# EasyEDA Pro project USB转串口.eprj

# Schematic USB转串口原理图
Board Name: USB转串口; Create Date: 2025-07-15; Page Name: P1; Project Name: USB转串口; Schematic Name: USB转串口原理图; Update Date: 2025-07-18; Company: 嘉立创EDA; Page Size: A4; Version: V1.0
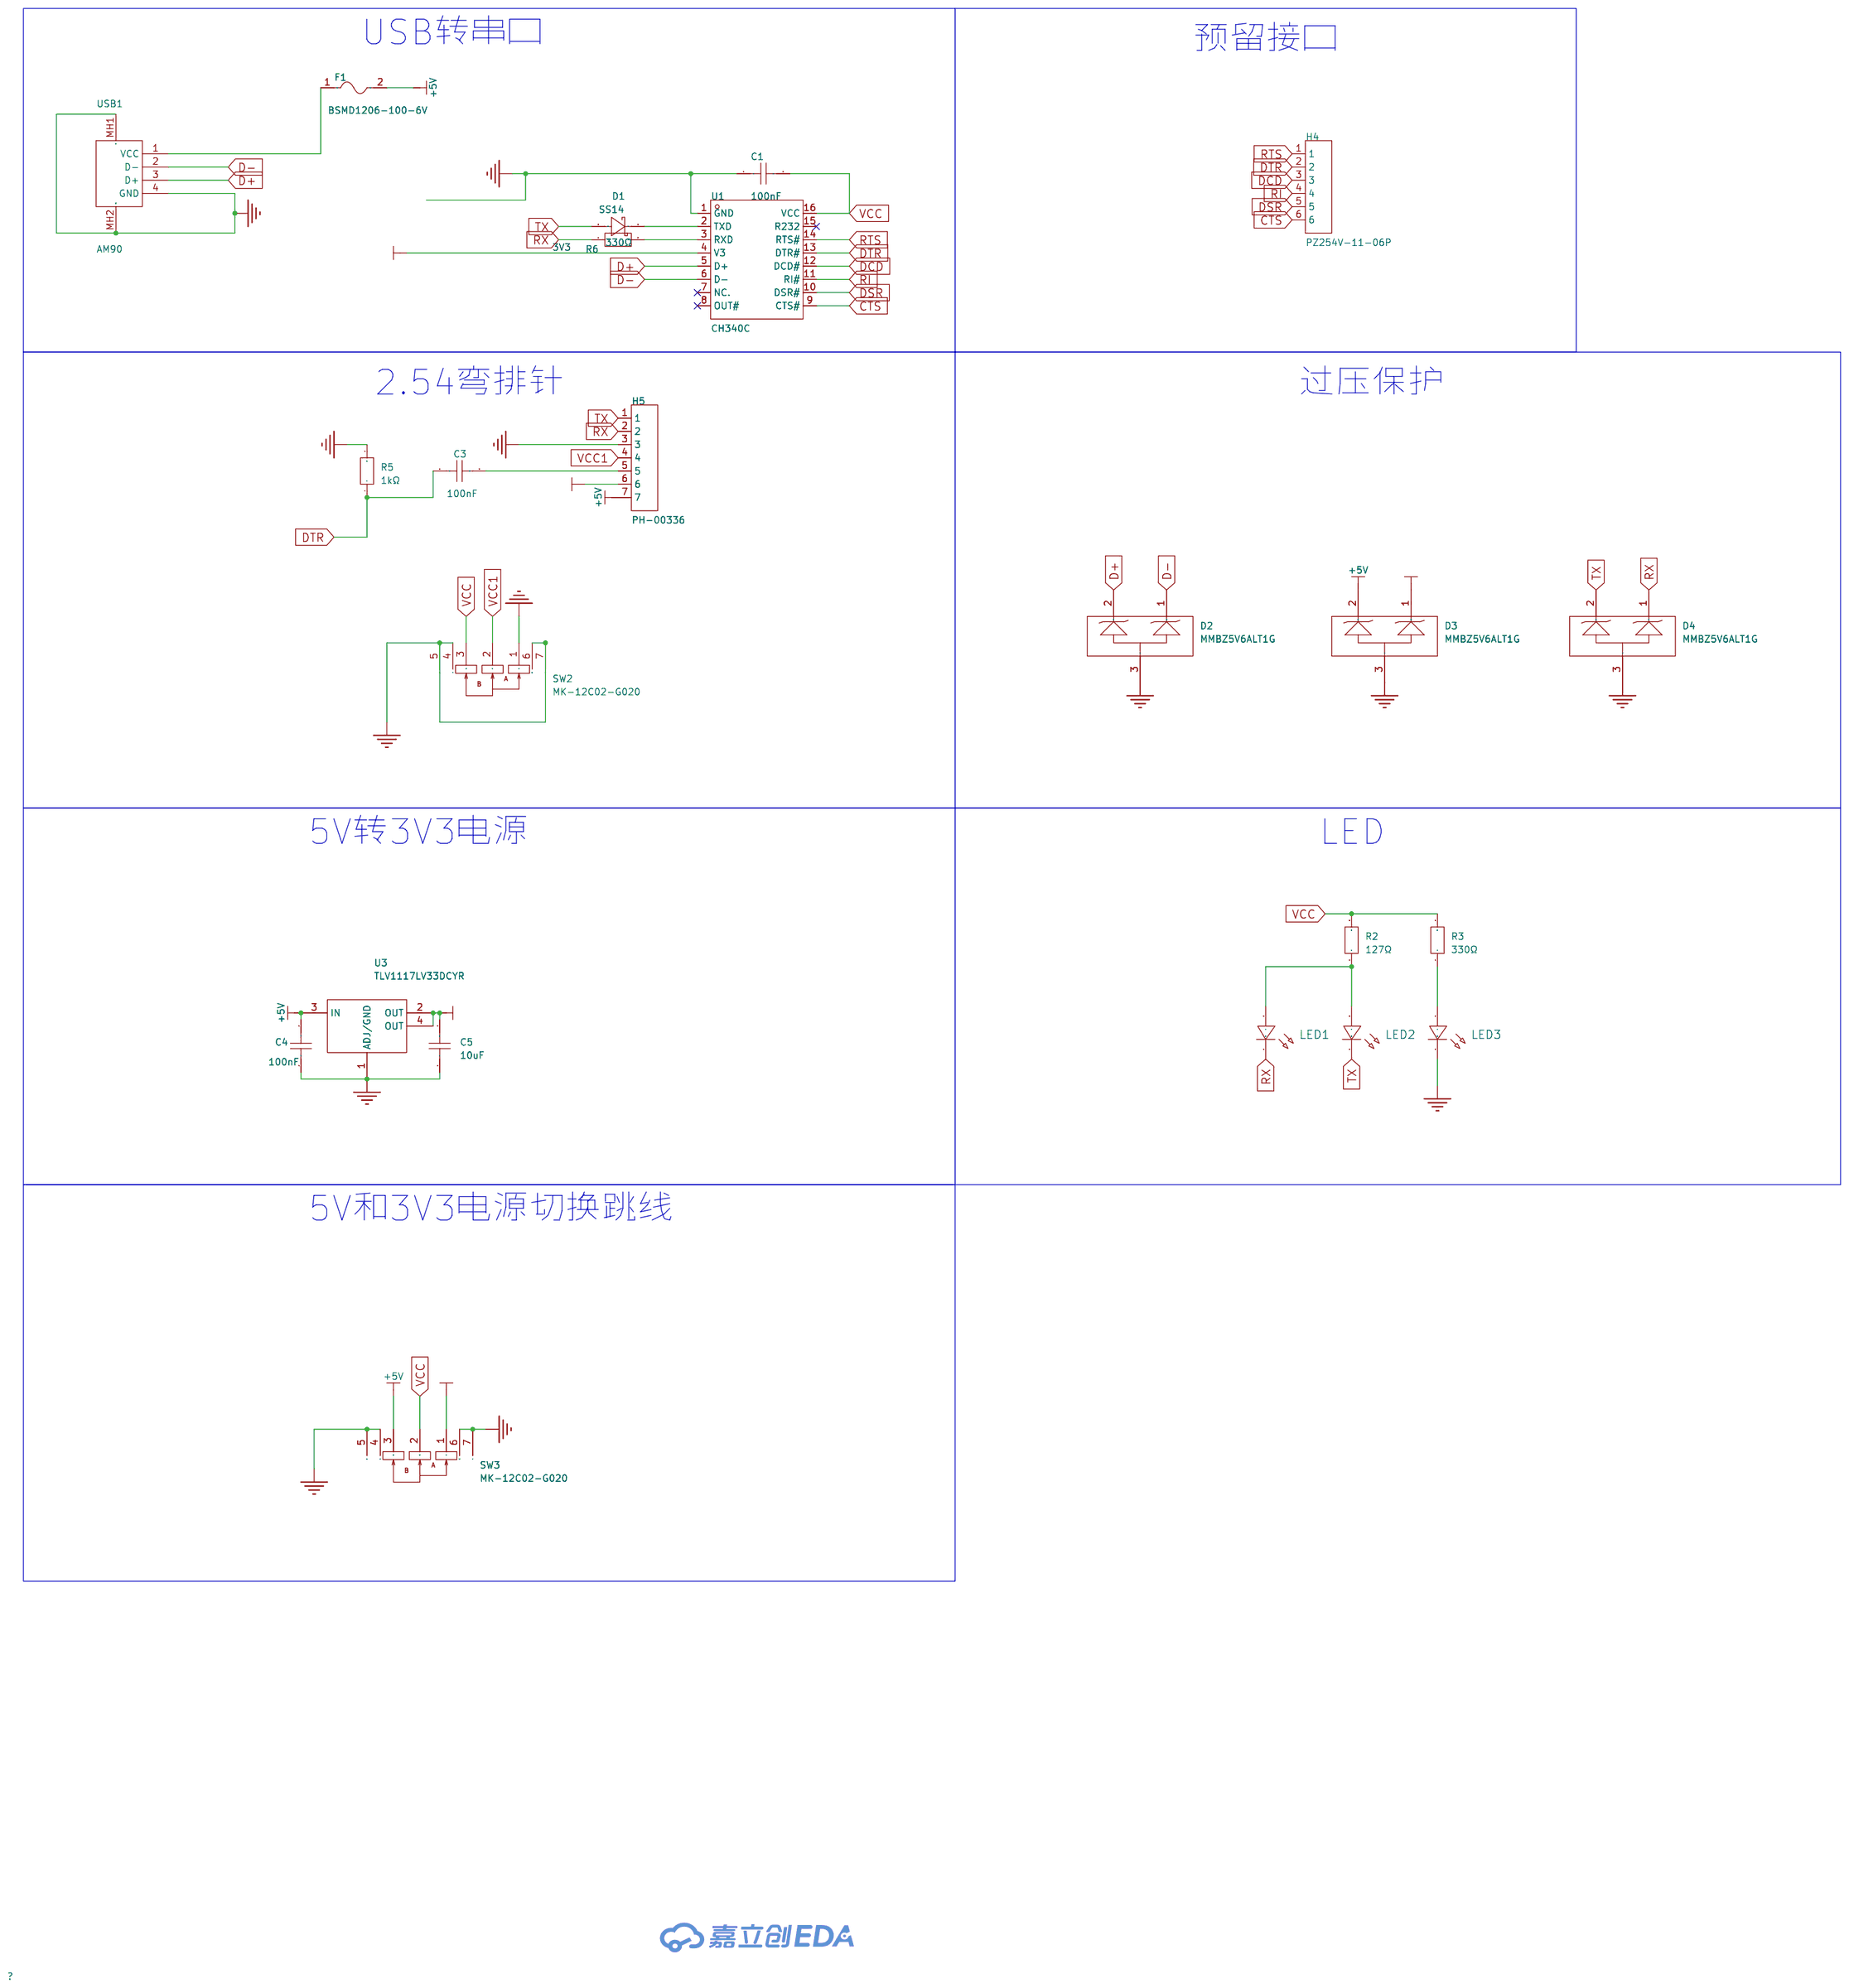
[diagram p0: schematic sheet]

## Parts
C1  100nF  [C0805]
C3  100nF  [C0805]
C4  100nF  [C0805]
C5  10uF  [C0805]
D1  SS14  [SMA_L4.3-W2.6-LS5.0-RD]
D2  MMBZ5V6ALT1G  [SOT-23_L2.9-W1.3-P1.90-LS2.4-BR]
D3  MMBZ5V6ALT1G  [SOT-23_L2.9-W1.3-P1.90-LS2.4-BR]
D4  MMBZ5V6ALT1G  [SOT-23_L2.9-W1.3-P1.90-LS2.4-BR]
F1  BSMD1206-100-6V  [F1206]
H4  PZ254V-11-06P  [HDR-TH_6P-P2.54-V-M]
H5  PH-00336  [HDR-TH_7P-P2.54-V-M]
LED1  -  [LED_0603]
LED2  -  [LED_0603]
LED3  -  [LED_0603]
R2  127Ω  [R0805]
R3  330Ω  [R0805]
R5  1kΩ  [R0805]
R6  330Ω  [R0805]
SW2  MK-12C02-G020  [SW-SMD_MK-12C02-G020]
SW3  MK-12C02-G020  [SW-SMD_MK-12C02-G020]
U1  CH340C  [SOP-16_L10.0-W3.9-P1.27-LS6.0-BL]
U3  TLV1117LV33DCYR  [SOT-223_L6.7-W3.5-P2.30-BR]
USB1  AM90  [USB-AM-TH_AM90]

## Library data of the parts
C1 C3 C4 = 08055C104KAT4A: LCSC Part Name: 100nF ±10% 50V; Supplier Part: C2167422; Manufacturer: Kyocera AVX; Supplier Footprint: 0805; JLCPCB Part Class: 扩展库; Datasheet: https://atta.szlcsc.com/upload/public/pdf/source/20211125/9559F68C371FC513E807C3C71A51015C.pdf; Supplier: LCSC; Tolerance: ±10%; Voltage Rating: 50V; Temperature Coefficient: X7R
C5 = CGA0805X6S106M160MT: LCSC Part Name: 10uF ±20% 16V; Supplier Part: C6119910; Manufacturer: HRE(芯声); Supplier Footprint: 0805; JLCPCB Part Class: 扩展库; Supplier: LCSC; Tolerance: ±20%; Voltage Rating: 16V; Temperature Coefficient: X6S
D1 = SS14_C727050: LCSC Part Name: 电压:40V 电流:1A; Supplier Part: C727050; Manufacturer: TWGMC(台湾迪嘉); Supplier Footprint: SMA(DO-214AC); JLCPCB Part Class: 扩展库; Datasheet: https://atta.szlcsc.com/upload/public/pdf/source/20200828/C727049_15C374FD74575EB3C6CB20C4F8F2D77A.pdf; Supplier: LCSC; Diode Configuration: 独立式; Forward Voltage (Vf@If): 550mV@1A; Reverse Voltage (Vr): 40V; Rectified Current: 1A; Reverse Leakage Current (Ir): 500uA
D2-D4 = MMBZ5V6ALT1G: Supplier Part: C123251; Manufacturer: onsemi(安森美); Supplier Footprint: SOT-23; JLCPCB Part Class: 扩展库; Datasheet: https://atta.szlcsc.com/upload/public/pdf/source/20180316/64EDD40BDF72533A9556DC091004FF68.pdf; Supplier: LCSC; Reverse Stand-Off Voltage (Vrwm): 3V; Maximum Clamping Voltage: 8V; Peak Pulse Power Dissipation (Ppp)@10/1000us: 24W; Breakdown Voltage: 5.32V; Number of Lines: 双路; Operating Temperature: -55℃~+150℃@(Tj); Type: ESD
F1 = BSMD1206-100-6V: LCSC Part Name: 1206 1A 6V 国产自恢复; Supplier Part: C883129; Manufacturer: BHFUSE(佰宏); Supplier Footprint: 1206; JLCPCB Part Class: 扩展库; Datasheet: https://atta.szlcsc.com/upload/public/pdf/source/20250212/FB96FB30E33193B14368CE94976BC83E.pdf; Supplier: LCSC; Voltage - Max: 6V; Current - Max: 100A; Hold Current: 1A; Trip Current: 1.8A; Power Dissipation: 800mW; Resistance - Initial (Ri) (Min): 50mΩ; Resistance - Post Trip (R1) (Max): 270mΩ; Time to Trip(Max): 300ms; Operating Temperature: -40℃~+85℃
H4 = PZ254V-11-06P: LCSC Part Name: 1x6P 间距:2.54mm 方针 直插; Supplier Part: C492405; Manufacturer: XFCN(兴飞); Supplier Footprint: 插件,P=2.54mm; JLCPCB Part Class: 扩展库; Datasheet: https://atta.szlcsc.com/upload/public/pdf/source/20200309/C492405_597F1930F5B55CC3C7FD95458F1C3977.pdf; Supplier: LCSC; Pin Structure: 1x6P; Pitch: 2.54mm; Circluar Pins/Square Pins: 方针; Mounting Type: 直插; Number of Rows: 单排; Number of Pins: 6P; Length of Mating Pin: 6mm; Insulation Height: 2.5mm; Length of End Connection Pin: 3mm; Contact Material: 黄铜; Operating Temperature: -40℃~+105℃; Color: 黑色
H5 = PH-00336: LCSC Part Name: 1x7P 间距:2.54mm 方针 直插; Supplier Part: C2685153; Manufacturer: Liansheng(连盛); Supplier Footprint: 插件,P=2.54mm; JLCPCB Part Class: 扩展库; Datasheet: https://atta.szlcsc.com/upload/public/pdf/source/20210125/C2685153_3D52DE13B40DCDA378EF140FF7C18578.pdf; Supplier: LCSC; Pin Structure: 1x7P; Pitch: 2.54mm; Circluar Pins/Square Pins: 方针; Mounting Type: 直插; Number of Rows: 单排; Number of Pins: 7P; Current Rating: 3A; Length of Mating Pin: 6mm; Insulation Height: 2.5mm; Length of End Connection Pin: 3mm; Operating Temperature: -40℃~+105℃; Color: 黑色
LED1-LED3 = LED_0603-R: Supplier Footprint: 0603
R2 = FRC0805F1270TS: LCSC Part Name: 127Ω ±1% 125mW 厚膜电阻; Supplier Part: C5159710; Manufacturer: FOJAN(富捷); Supplier Footprint: 0805; JLCPCB Part Class: 扩展库; Datasheet: https://atta.szlcsc.com/upload/public/pdf/source/20211221/925EC7D7225764EE0046F22065062C87.pdf; Supplier: LCSC; Type: 厚膜电阻; Tolerance: ±1%; Power(Watts): 125mW; Voltage-Supply(Max): 150V; Temperature Coefficient: ±100ppm/℃
R3 R6 = CRCW0805330RJNEA: LCSC Part Name: 厚膜电阻 330Ω ±5% 125mW; Supplier Part: C844209; Manufacturer: VISHAY(威世); Supplier Footprint: 0805; JLCPCB Part Class: 扩展库; Datasheet: https://atta.szlcsc.com/upload/public/pdf/source/20200927/C844045_6AA1A6DF5B555BABAEE9BB169E8C33AD.pdf; Supplier: LCSC; Type: 厚膜电阻; Tolerance: ±5%; Power(Watts): 125mW; Temperature Coefficient: ±200ppm/℃; Operating Temperature: -55℃~+155℃
R5 = HP05W3F1001T5E: LCSC Part Name: 1kΩ ±1% 333.333mW 厚膜电阻; Supplier Part: C2759346; Manufacturer: UNI-ROYAL(厚声); Supplier Footprint: 0805; JLCPCB Part Class: 扩展库; Datasheet: https://atta.szlcsc.com/upload/public/pdf/source/20191008/C414992_156DFCF59DCF6D7D87D733C605AEA251.pdf; Supplier: LCSC; Type: 厚膜电阻; Tolerance: ±1%; Power(Watts): 333mW; Voltage-Supply(Max): 150V; Temperature Coefficient: ±100ppm/℃; Operating Temperature: -55℃~+155℃
SW2 SW3 = MK-12C02-G020: LCSC Part Name: 微型拨动开关; Supplier Part: C963206; Manufacturer: G-Switch(品赞); Supplier Footprint: SMD; JLCPCB Part Class: 扩展库; Datasheet: https://atta.szlcsc.com/upload/public/pdf/source/20200902/C778186_2AF08473ED98414D93A175E8814EEFA6.pdf; Supplier: LCSC; Circuit: 单刀双掷; Actuator Style: 矩形柱状; Pin Style: SMD接片; Switch Length: 6.6mm; Switch Width: 2.7mm; Switch Height: 4.7mm; Mounting Style: 卧贴; Actuator Color: 黑色; Current Rating (DC): 1A; Voltage Rating (DC): 6V; Mechanical Life: 1万次; Operating Temperature: -20℃~+70℃
U1 = CH340C: Supplier Part: C84681; Manufacturer: WCH(南京沁恒); Supplier Footprint: SOP-16; JLCPCB Part Class: 扩展库; Datasheet: https://atta.szlcsc.com/upload/public/pdf/source/20240619/63986D8440D4E5267A77ACD891CC4DE3.pdf; Supplier: LCSC; Applications Function: 收发器; Protocol: USB 2.0; Voltage - Supply: 3.3V；5V; Data Rate: 2Mbps
U3 = TLV1117LV33DCYR: LCSC Part Name: 1A 低压降稳压器; Supplier Part: C15578; Manufacturer: TI(德州仪器); Supplier Footprint: SOT-223; JLCPCB Part Class: 扩展库; Datasheet: https://www.ti.com/cn/lit/gpn/tlv1117lv; Supplier: LCSC; Output Type: 固定; Maximum Input Voltage: 5.5V; Output Voltage: 3.3V; Output Current: 1A; Power Supply Rejection Ratio (PSRR): 75dB@(120Hz); Dropout Voltage: 1.3V@(800mA); standby current: 100uA; Feature: 防静电保护；低ESR；热保护(TSD)；过流保护(OCP)；欠压闭锁; Operating Temperature: -40℃~+125℃; Output Polarity: 正极; Number of Outputs: 1
USB1 = AM90: LCSC Part Name: Type-A 公 弯插; Supplier Part: C404965; Manufacturer: SHOU HAN(首韩); Supplier Footprint: 插件; JLCPCB Part Class: 扩展库; Datasheet: https://atta.szlcsc.com/upload/public/pdf/source/20190722/C404965_9CC10BE28E3F9E5134758D030387C529.pdf; Supplier: LCSC; Connector Type: Type-A; Standard: USB 2.0; Gender: 公; Mounting Style: 弯插; Number of Contacts: 4P; Number of Ports: 1; Current Rating - Power (Max): 1.5A; Rated Voltage (Max): 30V; Connect-Disconnect Life: 5千次; Length: 18.8mm; Core Colour: 白色; Operating Temperature Range: -25℃~+85℃

## Nets
3V3: C5.2 D3.1(C) H5.6 SW3.1 U1.4(V3) U3.2(OUT) U3.4(OUT)
+5V: C4.2 D3.2(C) F1.2 H5.7 SW3.3 U3.3(IN)
GND: C1.1 C4.1 C5.1 D2.3(A) D3.3(A) D4.3(A) H5.3 LED3.1(C) R5.2 SW2.1 SW2.4 SW2.5 SW2.6 SW2.7 SW3.4 SW3.5 SW3.6 SW3.7 U1.1(GND) U3.1(ADJ/GND) USB1.4(GND) USB1.MH1 USB1.MH2
VCC: C1.2 R2.2 R3.2 SW2.3 SW3.2 U1.16(VCC)
VCC1: H5.4 SW2.2
CTS: H4.6 U1.9(CTS#)
D+: D2.2(C) U1.5(D+) USB1.3(D+)
D-: D2.1(C) U1.6(D-) USB1.2(D-)
DCD: H4.3 U1.12(DCD#)
DSR: H4.5 U1.10(DSR#)
DTR: C3.1 H4.2 R5.1 U1.13(DTR#)
RI: H4.4 U1.11(RI#)
RTS: H4.1 U1.14(RTS#)
RX: D4.1(C) H5.2 LED1.1(C) R6.1
TX: D1.2(A) D4.2(C) H5.1 LED2.1(C)
$1N1039: D1.1(K) U1.2(TXD)
$1N1157: R6.2 U1.3(RXD)
$1N1448: F1.1 USB1.1(VCC)
$1N1866: C3.2 H5.5
$1N3736: LED1.2(A) LED2.2(A) R2.1
$1N3753: LED3.2(A) R3.1

Not connected (* = marked no-connect by the designer): U1 7(NC.)* 8(OUT#)* 15(R232)*

## Notes on the sheet
- USB转串口
- 预留接口
- 2.54弯排针
- 过压保护
- 5V转3V3电源
- LED
- 5V和3V3电源切换跳线

# Board USB转串口PCB
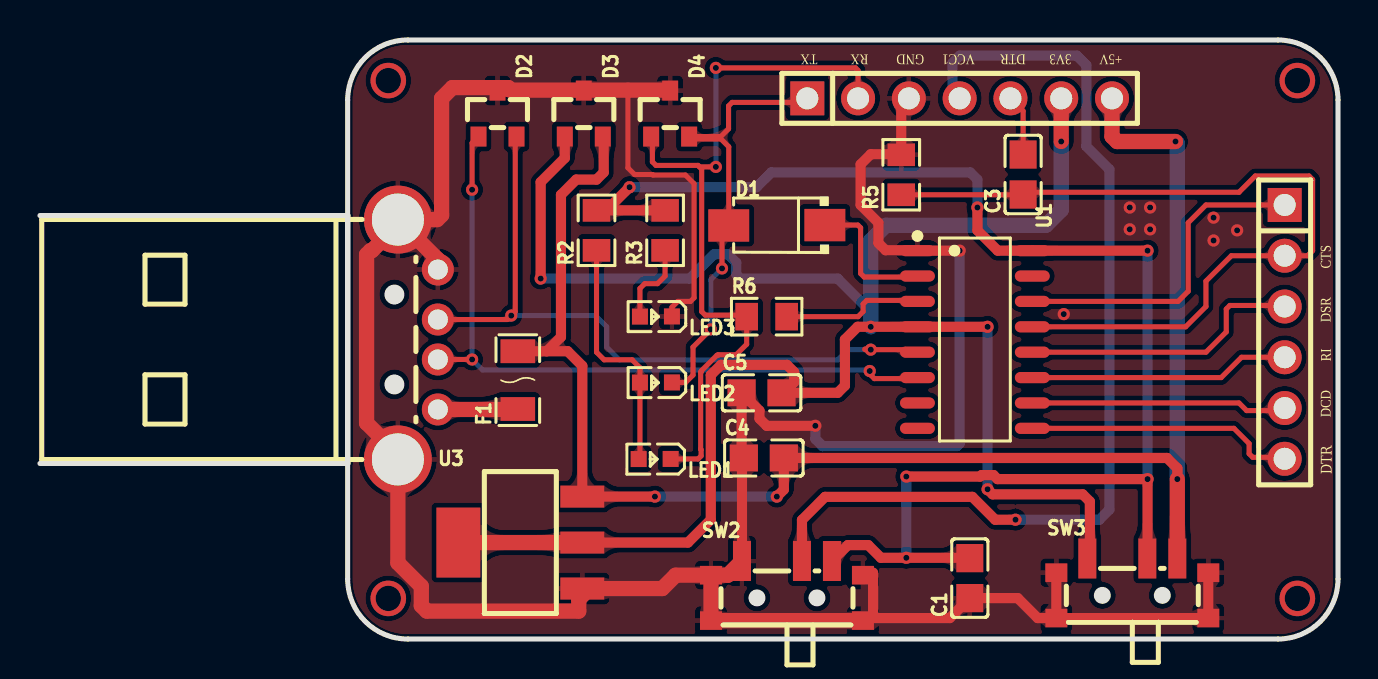
[diagram p1: board, top side]
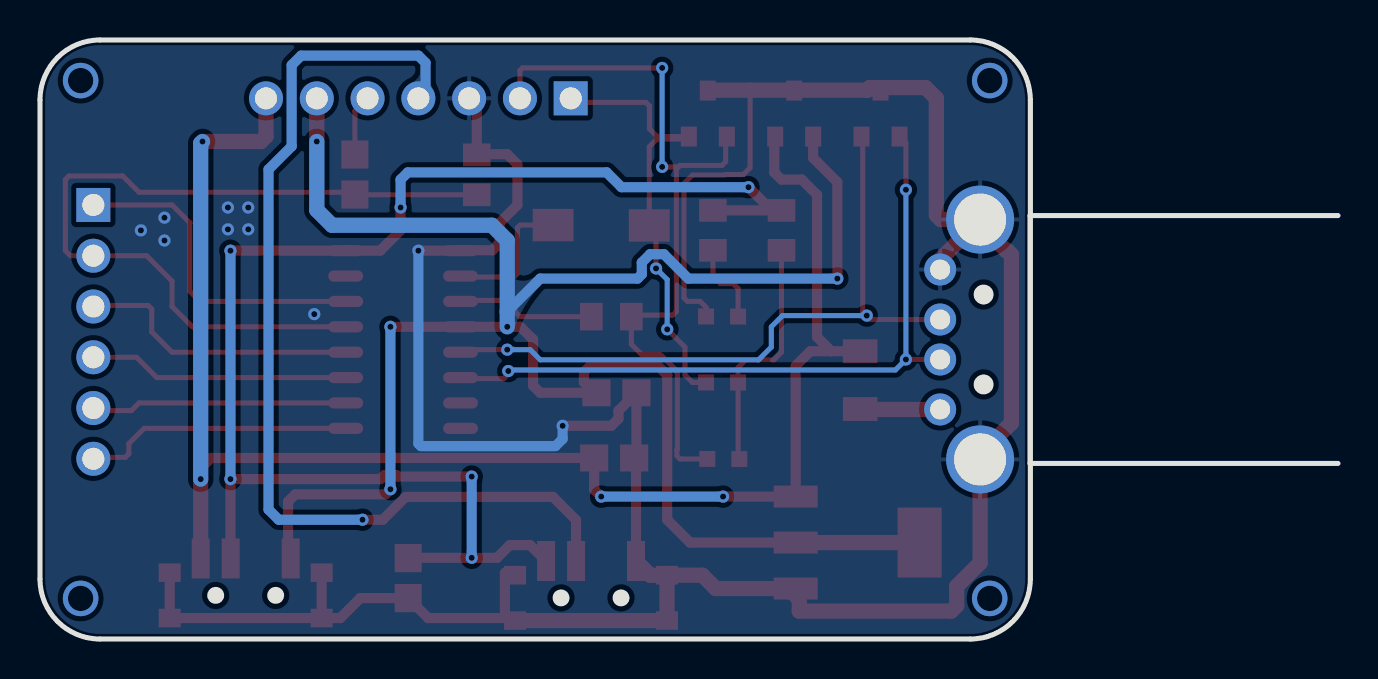
[diagram p2: board, bottom side, seen from below]

Outline 64.92 x 29.97 mm; copper layers: Top Layer, Bottom Layer. Coordinates in mm from the lower left corner of the outline.
Outline path: 15.39,26.97 15.39,3 arc(16.27,0.88) 18.39,0 61.92,0 arc(64.04,0.88) 64.92,3 64.92,26.97 arc(64.04,29.09) 61.92,29.97 18.39,29.97 arc(16.27,29.09) 15.39,26.97
Stack: Top Layer 0.035mm / Dielectric1 1.51mm FR4 er 4.5 / Bottom Layer 0.035mm

## Design rules (mm)
template: JLCPCB Capability(Two Layers Board)
spacing copperThickness1oz (default): track to track 0.102, other pairs 0.152 to 0.3
spacing copperThickness2oz: track to track 0.203, other pairs 0.152 to 0.3
track width copperThickness1oz (default): min 0.127, default 0.254, max 2.54
track width copperThickness2oz: min 0.203, default 0.254, max 2.54
differential pair differentialPair (default): width min 0.127, default 0.254, max 2.54; gap min 0.152, default 0.152
via viaSize (default): diameter min 0.5, default 0.61, max 10; hole min 0.3, default 0.305, max 6.3

## Placement (name value [footprint] x y rotation side)
C1  100nF  [C0805]  46.5 3.05 90 top
C3  100nF  [C0805]  49.17 23.24 90 top
C4  100nF  [C0805]  36.2 9.06 0 top
C5  10uF  [C0805]  36.09 12.32 0 top
D1  SS14  [SMA_L4.3-W2.6-LS5.0-RD]  36.85 20.7 180 top
D2  MMBZ5V6ALT1G  [SOT-23_L2.9-W1.3-P1.90-LS2.4-BR]  22.88 26.29 270 top
D3  MMBZ5V6ALT1G  [SOT-23_L2.9-W1.3-P1.90-LS2.4-BR]  27.2 26.29 270 top
D4  MMBZ5V6ALT1G  [SOT-23_L2.9-W1.3-P1.90-LS2.4-BR]  31.52 26.29 270 top
F1  BSMD1206-100-6V  [F1206]  23.9 12.95 90 top
H4  PZ254V-11-06P  [HDR-TH_6P-P2.54-V-M]  62.25 15.37 270 top
H5  PH-00336  [HDR-TH_7P-P2.54-V-M]  46 27.05 0 top
LED1  -  [LED_0603]  30.69 9 180 top
LED2  -  [LED_0603]  30.76 12.83 180 top
LED3  -  [LED_0603]  30.76 16.13 180 top
R2  127Ω  [R0805]  27.83 20.45 90 top
R3  330Ω  [R0805]  31.26 20.45 90 top
R5  1kΩ  [R0805]  43.07 23.23 90 top
R6  330Ω  [R0805]  36.34 16.13 0 top
SW2  MK-12C02-G020  [SW-SMD_MK-12C02-G020]  37.36 2.41 0 top
SW3  MK-12C02-G020  [SW-SMD_MK-12C02-G020]  54.63 2.54 0 top
U1  CH340C  [SOP-16_L10.0-W3.9-P1.27-LS6.0-BL]  46.76 14.99 270 top
U3  TLV1117LV33DCYR  [SOT-223_L6.7-W3.5-P2.30-BR]  24.02 4.83 0 top
USB1  AM90  [USB-AM-TH_AM90]  18.9 14.99 270 top

## Footprints (pads in the part's own frame, mm; a bottom-side part is the same pattern mirrored in y, then rotated)
C0805
  rect 1.41x1.35 smd: 1(-1,0) 2(1,0)
F1206
  rect 1.19x1.728 smd: 1(-1.445,0) 2(1.445,0)
HDR-TH_6P-P2.54-V-M
  rect 1.7x1.7 hole 1.1: 1(-6.35,0)
  round 1.7 hole 1.1: 2(-3.81,0) 3(-1.27,0) 4(1.27,0) 5(3.81,0) 6(6.35,0)
HDR-TH_7P-P2.54-V-M
  rect 1.7x1.7 hole 1.1: 1(-7.62,0)
  round 1.7 hole 1.1: 2(-5.08,0) 3(-2.54,0) 4(0,0) 5(2.54,0) 6(5.08,0) 7(7.62,0)
LED_0603
  rect 0.8x0.8 smd: 1(-0.851,-0.01) 2(0.75,-0.005)
R0805
  rect 1.133x1.377 smd: 1(-1,0) 2(1,0)
SMA_L4.3-W2.6-LS5.0-RD
  rect 2.046x1.62 smd: 1(-2.404,-0.009) 2(2.404,0.009)
SOP-16_L10.0-W3.9-P1.27-LS6.0-BL
  oval 0.56x1.745 smd: 1(-4.445,-2.873) 2(-3.175,-2.873) 3(-1.905,-2.873) 4(-0.635,-2.873) 5(0.635,-2.873) 6(1.905,-2.873) 7(3.175,-2.873) 8(4.445,-2.873) 9(4.445,2.873) 10(3.175,2.873) 11(1.905,2.873) 12(0.635,2.873) 13(-0.635,2.873) 14(-1.905,2.873) 15(-3.175,2.873) 16(-4.445,2.873)
SOT-23_L2.9-W1.3-P1.90-LS2.4-BR
  rect 1x0.8 smd: 1(1.15,-0.95) 2(1.15,0.95) 3(-1.15,0)
SOT-223_L6.7-W3.5-P2.30-BR
  rect 2.2x1.1 smd: 1(3.099,-2.3) 2(3.099,0) 3(3.099,2.3)
  rect 2.2x3.5 smd: 4(-3.099,0)
SW-SMD_MK-12C02-G020
  rect 0.9x2 smd: 1(-2.25,1.49) 2(0.75,1.49) 3(2.25,1.49)
  rect 1.1x0.93 smd: 4(3.8,0.779) 5(3.8,-1.49) 6(-3.8,-1.49) 7(-3.8,0.779)
USB-AM-TH_AM90
  round 1.6 hole 1: 1(3.5,1) 2(1,1) 3(-1,1) 4(-3.5,1)
  round 3.4 hole 2.6: MH1(6,-1) MH2(-6,-1)

## Nets
As in the schematic.

Pads without a net: U1 7 8 15

## Via types
v1: diameter 1.778, hole 1.27, Top Layer to Bottom Layer, 4 vias
v2: diameter 0.61, hole 0.305, Top Layer to Bottom Layer, 35 vias

## Routing (per net, layer and track width the routed paths; a pad name or vN(x,y) marks a point on that pad's centre or on a via; arc(x,y) is an arc through that point)
3V3: length 101.8
  Top Layer w0.508: SW3.1 52.51,4.16 52.51,6.88 52.15,7.24 47.65,7.24 v2(47.39,7.49) ; 27.12,4.83 32.41,4.83 33.55,5.97 33.55,13.21 34.06,13.72 37.36,13.72 37.72,13.36 37.72,12.85 37.19,12.32 ; v2(47.39,15.62) U1.4 v2(41.55,15.62) 40.89,15.62 40.26,14.99 40.26,12.68 39.9,12.32 37.19,12.32 ; 37.19,12.32 C5.2 ; 26.25,25.14 26.25,24.07 25.04,22.86 v2(25.04,18.03)
  Top Layer w0.762: U3.4 27.12,4.83 ; H5.6 v2(51.08,24.89)
  Bottom Layer w0.508: 41.55,16.38 39.9,18.03 35.03,18.03 34.82,18.25 34.82,18.84 34.4,19.25 33.71,19.25 32.5,18.03 v2(25.04,18.03) ; v2(47.39,7.49) v2(47.39,15.62)
  Bottom Layer w0.762: v2(51.08,24.89) 51.08,21.46 50.31,20.7 42.31,20.7 41.55,19.94 v2(41.55,15.62)
+5V: length 80.9
  Top Layer w0.508: 25.34,14.4 26.06,15.11 26.06,22.22 26.82,22.99 27.83,22.99 28.19,23.35 28.19,25.09 28.15,25.14 ; 25.34,14.4 23.9,14.4 ; 25.34,14.4 26.39,14.4 27.12,13.66 27.12,7.13 v2(30.76,7.13) ; v2(36.85,7.13) 37.2,7.48 C4.2 56.37,9.06 56.88,8.54 v2(56.88,8)
  Top Layer w0.762: H5.7 53.62,25.15 53.87,24.89 v2(56.79,24.89) ; SW3.3 v2(56.88,8)
  Bottom Layer w0.508: v2(30.76,7.13) v2(36.85,7.13)
  Bottom Layer w0.762: v2(56.79,24.89) 56.88,24.8 v2(56.88,8)
GND: length 156.5
  Top Layer w0.254: LED3.1 31.61,16.6 31.9,16.89 32.53,16.89 32.71,17.07 32.71,22.78 32.28,23.21 30.66,23.21 30.63,23.24 29.74,23.24 29.4,23.58 29.4,27.46
  Top Layer w0.508: v2(38.78,10.67) 36.34,10.67 35.98,11.03 35.98,11.42 C5.1 35.09,9.17 C4.1 35.11,8.97 SW2.1 ; H5.3 43.07,26.67 R5.2 43.04,24.26 41.55,24.26 41.04,23.75 41.04,21.72 41.93,20.83 41.93,19.81 42.29,19.45 43.86,19.45 U1.1 v2(46,19.43) ; SW3.4 SW3.5 50.83,1.05 ; 50.83,1.05 49.9,1.05 48.9,2.05 C1.1 45.5,1.05 41.67,1.05 41.67,3.32 ; 50.83,1.05 50.83,3.32
  Top Layer w0.762: USB1.4 19.9,18.99 USB1.MH2 ; 27.48,2.53 31.12,2.53 31.79,3.19 SW2.7 ; 27.48,2.53 27.12,2.53 ; 27.48,2.53 26.95,1.99 26.95,1.4 19.35,1.4 19.07,1.67 19.07,2.64 17.9,3.81 USB1.MH1 17.9,9.24 16.33,10.8 16.33,19.23 16.53,19.43 16.6,19.43 17.9,20.73 USB1.MH2 ; 23.56,27.46 23.43,27.59 23.01,27.59 ; 23.56,27.46 23.01,27.59 ; 23.56,27.46 27.22,27.46 ; SW2.7 34.4,3.19 SW2.1 ; SW2.7 SW2.6 SW2.5 ; USB1.MH2 19.86,20.99 20.09,21.21 20.09,27.05 20.63,27.59 23.01,27.59 ; 31.51,27.46 27.31,27.46
  Bottom Layer w0.508: v2(46,19.43) 46,9.78 45.87,9.65 39.14,9.65 38.78,10.01 v2(38.78,10.67)
  vias: v2(51.2,16.26) v2(54.5,21.59) v2(54.5,20.5) v2(55.52,21.59) v2(55.52,20.5) v2(58.7,21.08) v2(58.7,19.94) v2(59.87,20.45)
VCC: length 73.5
  Top Layer w0.508: 28.33,21.45 R2.2 ; 28.33,21.45 v2(29.49,22.61) ; 28.33,21.45 R3.2 ; SW2.3 40.4,4.7 41.42,4.7 42.06,4.06 v2(43.33,4.06) 46.49,4.06 C1.2 ; SW3.2 55.39,4.04 v2(55.39,8) 47.89,8 47.69,8.2 47.1,8.2 47.02,8.13 v2(43.33,8.13) ; v2(46.88,21.59) 46.88,20.45 47.9,19.43 U1.16 v2(55.39,19.43)
  Bottom Layer w0.508: v2(43.33,8.13) v2(43.33,4.06) ; v2(55.39,19.43) v2(55.39,8) ; v2(29.49,22.61) 35.84,22.61 36.58,23.35 46.53,23.35 46.88,22.99 v2(46.88,21.59)
VCC1: length 50.3
  Top Layer w0.508: SW2.2 38.11,5.96 39.26,7.11 46.63,7.11 47.77,5.97 v2(48.79,5.97)
  Bottom Layer w0.508: H5.4 45.64,27.41 45.64,28.83 46,29.19 51.86,29.19 52.33,28.72 52.33,24.65 53.49,23.49 53.49,6.48 52.98,5.97 v2(48.79,5.97)
(no net):
  vias: v1(17.42,27.94) v1(17.42,2.03) v1(62.89,27.94) v1(62.89,2.03)
CTS: length 13.6
  Top Layer w0.254: U1.9 59.71,10.54 60.47,9.78 60.47,9.27 60.65,9.09 62.18,9.09 H4.6
D+: length 35.5
  Top Layer w0.254: 43.88,14.35 43.76,14.48 41.76,14.48 41.74,14.5 41.26,14.5 41.28,14.48 v2(41.55,14.48) ; 23.83,25.14 23.77,25.08 23.77,16.38 23.37,15.99 USB1.3
  Bottom Layer w0.254: v2(23.57,16.18) 27.78,16.18 28.34,15.62 28.34,14.6 28.98,13.97 39.9,13.97 40.41,14.48 v2(41.55,14.48)
D-: length 35.8
  Top Layer w0.254: v2(41.5,13.41) 41.55,13.36 41.55,13.21 41.73,13.03 43.83,13.03 U1.6 ; USB1.2 v2(21.61,13.99) ; v2(21.61,22.48) 21.61,24.82 21.93,25.14
  Bottom Layer w0.254: v2(21.61,22.48) v2(21.61,13.99) 22.14,13.46 41.45,13.46 v2(41.5,13.41)
DCD: length 14.3
  Top Layer w0.254: 49.63,14.35 58.31,14.35 59.33,15.37 59.33,16.51 59.51,16.69 62.2,16.69 H4.3
DSR: length 12.8
  Top Layer w0.254: H4.5 62.12,11.43 60.35,11.43 59.97,11.81 U1.10
DTR: length 40.9
  Top Layer w0.254: R5.1 49.16,22.23 C3.1 49.28,22.35 59.97,22.35 60.78,23.17 63.47,23.17 63.65,22.99 63.65,19.43 63.39,19.18 H4.2 59.58,19.18 58.31,17.91 58.31,16.64 57.3,15.62 U1.13
RI: length 13
  Top Layer w0.254: U1.11 59.08,13.08 60.09,14.1 H4.4
RTS: length 16.6
  Top Layer w0.254: U1.14 56.92,16.89 57.43,17.4 57.43,20.83 58.31,21.72 H4.1
RX: length 37.8
  Top Layer w0.254: LED1.1 32.91,9.01 33.07,9.16 33.07,9.47 33.04,9.49 33.04,13.33 33.07,13.36 33.07,13.41 33.86,14.2 33.91,14.2 33.93,14.22 34.82,14.22 35.34,14.75 R6.1 35.27,16.2 33.27,16.2 33.09,16.38 33.09,23.52 32.99,23.62 ; v2(33.8,28.57) 40.79,28.57 40.92,28.45 H5.2 ; 32.99,23.62 32.91,23.7 30.81,23.7 30.63,23.88 30.63,25.08 30.57,25.14 ; 32.99,23.62 v2(33.8,23.62)
  Bottom Layer w0.254: v2(33.8,28.57) v2(33.8,23.62)
TX: length 22.9
  Top Layer w0.254: H5.1 38.17,26.85 34.62,26.85 34.44,26.67 34.44,25.53 34.05,25.14 32.47,25.14 32.59,25.02 34.06,25.02 34.45,24.63 D1.2 34.11,20.35 v2(34.11,18.54) ; 31.61,12.84 32.29,12.84 32.66,13.21 32.66,14.6 v2(33.55,15.49)
  Bottom Layer w0.254: v2(34.11,18.54) 33.55,17.98 v2(33.55,15.49)
$1N1039: length 7.1
  Top Layer w0.254: D1.1 40.91,20.71 41.04,20.57 41.04,18.29 41.22,18.11 43.83,18.11 U1.2
$1N1157: length 7.1
  Top Layer w0.254: R6.2 40.92,16.13 41.17,16.38 41.17,16.76 41.35,16.94 43.83,16.94 U1.3
$1N1448: length 4
  Top Layer w0.762: USB1.1 23.87,11.49 F1.1
$1N1866: length 3.1
  Top Layer w0.254: H5.5 49.17,26.42 C3.2
$1N3736: length 12.2
  Top Layer w0.254: R2.1 27.83,14.35 28.22,13.97 29.61,13.97 30.01,13.58 LED2.2 30.01,9.07 LED1.2
$1N3753: length 4.2
  Top Layer w0.254: LED3.2 30.01,17.54 30.25,17.78 30.88,17.78 31.26,18.16 R3.1

## Copper pours and planes (outline as drawn; the poured copper is in the pictures)
GND on Top Layer: 4.47,33.15 73.17,33.15 73.17,-5.21 4.47,-5.21
GND on Top Layer: 12.47,32.13 66.7,32.13 66.7,-3.18 12.47,-3.18
GND on Top Layer: 14.25,30.73 67.84,30.73 67.84,-1.4 14.25,-1.4
GND on Top Layer: 13.48,31.62 66.57,31.62 66.57,-2.54 13.48,-2.54
GND on Bottom Layer: 14.12,30.99 66.44,30.99 66.44,-2.03 14.12,-2.03

Small or netless copper shapes (teardrops, artwork), in the pictures only: 137 on Top Layer, 27 on Bottom Layer

## Text on the board
Top Silkscreen Layer: DTR | TX | RX | GND | VCC1 | 3V3 | +5V | CTS | DSR | DCD | RI
